# Altium schematic sheet Sheet1.SchDoc
size A; SheetNumber: 1; SheetTotal: 1
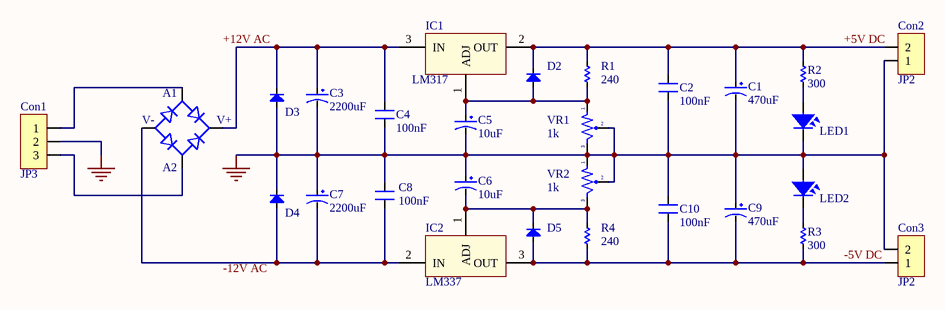
[diagram p0: Sheet1.SchDoc]

## Parts
C1  470uF  [CA-ALU-6.3]
C2  100nF  [CN1.5]
C3  2200uF  [CA-ALU-10]
C4  100nF  [CN1.5]
C5  10uF  [CA-ALU-5]
C6  10uF  [CA-ALU-5]
C7  2200uF  [CA-ALU-10]
C8  100nF  [CN1.5]
C9  470uF  [CA-ALU-6.3]
C10  100nF  [CN1.5]
Con1  JP3  [KF3-3.5]
Con2  JP2  [KF2-3.5]
Con3  JP2  [KF2-3.5]
D2  Diode  [DIO-1A-SMALL]  (value not drawn)
D3  Diode  [DIO-1A-SMALL]  (value not drawn)
D4  Diode  [DIO-1A-SMALL]  (value not drawn)
D5  Diode  [DIO-1A-SMALL]  (value not drawn)
DB1  Diode Brideg  [DIO-Bri 5A]  (value not drawn)
IC1  LM317  [TO220H2]
IC2  LM337  [TO220H2]
LED1  LED  [LED-5-RED]  (value not drawn)
LED2  LED  [LED-5-RED]  (value not drawn)
R1  240  [RES-1/4W-SMALL]
R2  300  [RES-1/4W-SMALL]
R3  300  [RES-1/4W-SMALL]
R4  240  [RES-1/4W-SMALL]
VR1  1k  [VR-S3]
VR2  1k  [VR-S3]

## Nets
GND: C1.2 C2.2 C3.2 C4.1 C5.2 C6.1 C7.1 C8.1 C9.1 C10.2 Con1.2 Con2.1 Con3.2 D3.1(A) D4.2(K) LED1.2 LED2.1 VR1.2 VR1.3 VR2.1 VR2.2
+5V DC: C1.1 C2.1 Con2.2 D2.2(K) IC1.2(OUT) R1.2 R2.2
-5V DC: C9.2 C10.1 Con3.1 D5.1(A) IC2.3(OUT) R3.1 R4.1
NetC3_1: C3.1 C4.2 D3.2(K) DB1.1(+V_OUT) IC1.3(IN)
NetC5_1: C5.1 D2.1(A) IC1.1(ADJ) R1.1 VR1.1
NetC6_2: C6.2 D5.2(K) IC2.1(ADJ) R4.2 VR2.3
NetC7_2: C7.2 C8.2 D4.1(A) DB1.4(-V_OUT) IC2.2(IN)
NetCon1_1: Con1.1 DB1.2(AC1)
NetCon1_3: Con1.3 DB1.3(AC2)
NetLED1_1: LED1.1 R2.1
NetLED2_2: LED2.2 R3.2

## Notes on the sheet
- Labels drawn without touching a wire or pin: +12V AC, -12V AC
- (in symbol Diode Brigde) A1; V-; V+; A2

## Library data of the parts
C1 C3 C5-C7 C9 = Capacitor P: Polarized
C2 C4 C8 C10 = Capacitor NP: Non-polarized; Value: 33pF
Con1 = Header 3: male/female; Manufacturer: W¨¹rth Elektronik eiSos GmbH; partNo: 613003143121; ComponentLink1 Description: Manufacturer; ComponentLink2 Description: Datasheet; NoPins: 03; Created Date: 29 March 2013; ComponentLink1URL: http://www.we-online.com; ComponentLink2URL: http://katalog.we-online.de/em/datasheet/6130xx143121.pdf; Created by: Karrer Zheng
Con2 Con3 = Header 2: male/female; Manufacturer: W¨¹rth Elektronik eiSos GmbH; partNo: 613002143121; ComponentLink1 Description: Manufacturer; ComponentLink2 Description: Datasheet; NoPins: 02; Created Date: 29 March 2013; ComponentLink1URL: http://www.we-online.com; ComponentLink2URL: http://katalog.we-online.de/em/datasheet/6130xx143121.pdf; Created by: Karrer Zheng
D2-D5 = Diode: Default Diode; Code - JEDEC: DO-214-AB; Value: 1N5007; Published: 8-Jun-2000; Revision: July-2002: Re-released for DXP Platform.; Publisher: Altium Limited
DB1 = Diode Brigde: Convert AC to DC voltage, 4 pin; Value: Cau 1A
IC1 = LM317: Adj Voltage +1.2 -> +37V; Value: LM317
IC2 = LM337: On ap (-)     -1.2 -> - 37V; Value: LM337
LED1 LED2 = LED: LED Single colour; Value: LED 3 ly Single Colour
R1-R4 = Resistor: Manufacturer: Generic Components; Class: Passive; SubClass: R; Published: 08/06/2000; Publisher: Altium Hobart Technology Centre
VR1 VR2 = Variable Resistor: Var Res; Value: Volume 50k